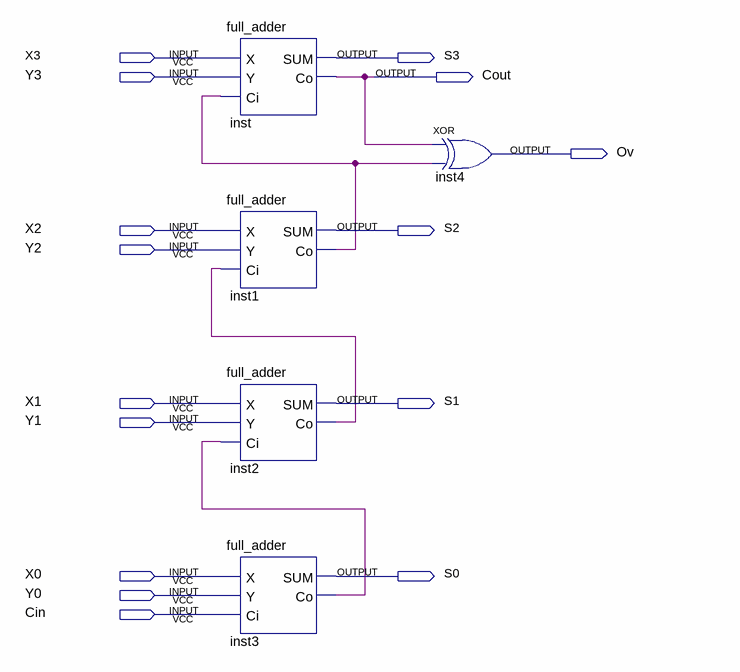
[diagram p0: schematic sheet]
// Quartus schematic adder_4bit.bdf as structural Verilog: 5 symbols, 15 pins
module adder_4bit (
  input  X3,
  input  Y3,
  input  X2,
  input  Y2,
  input  X1,
  input  Y1,
  input  X0,
  input  Y0,
  input  Cin,
  output S3,
  output Cout,
  output Ov,
  output S2,
  output S1,
  output S0
);

  wire inst1_co, inst2_co, inst3_co;

  full_adder inst (.X(X3), .Y(Y3), .Ci(inst1_co), .SUM(S3), .Co(Cout));
  full_adder inst1 (.X(X2), .Y(Y2), .Ci(inst2_co), .SUM(S2), .Co(inst1_co));
  full_adder inst2 (.X(X1), .Y(Y1), .Ci(inst3_co), .SUM(S1), .Co(inst2_co));
  full_adder inst3 (.X(X0), .Y(Y0), .Ci(Cin), .SUM(S0), .Co(inst3_co));
  xor inst4 (Ov, Cout, inst1_co);
endmodule
